# EAGLE design DTAG02 (EAGLE 4.15)
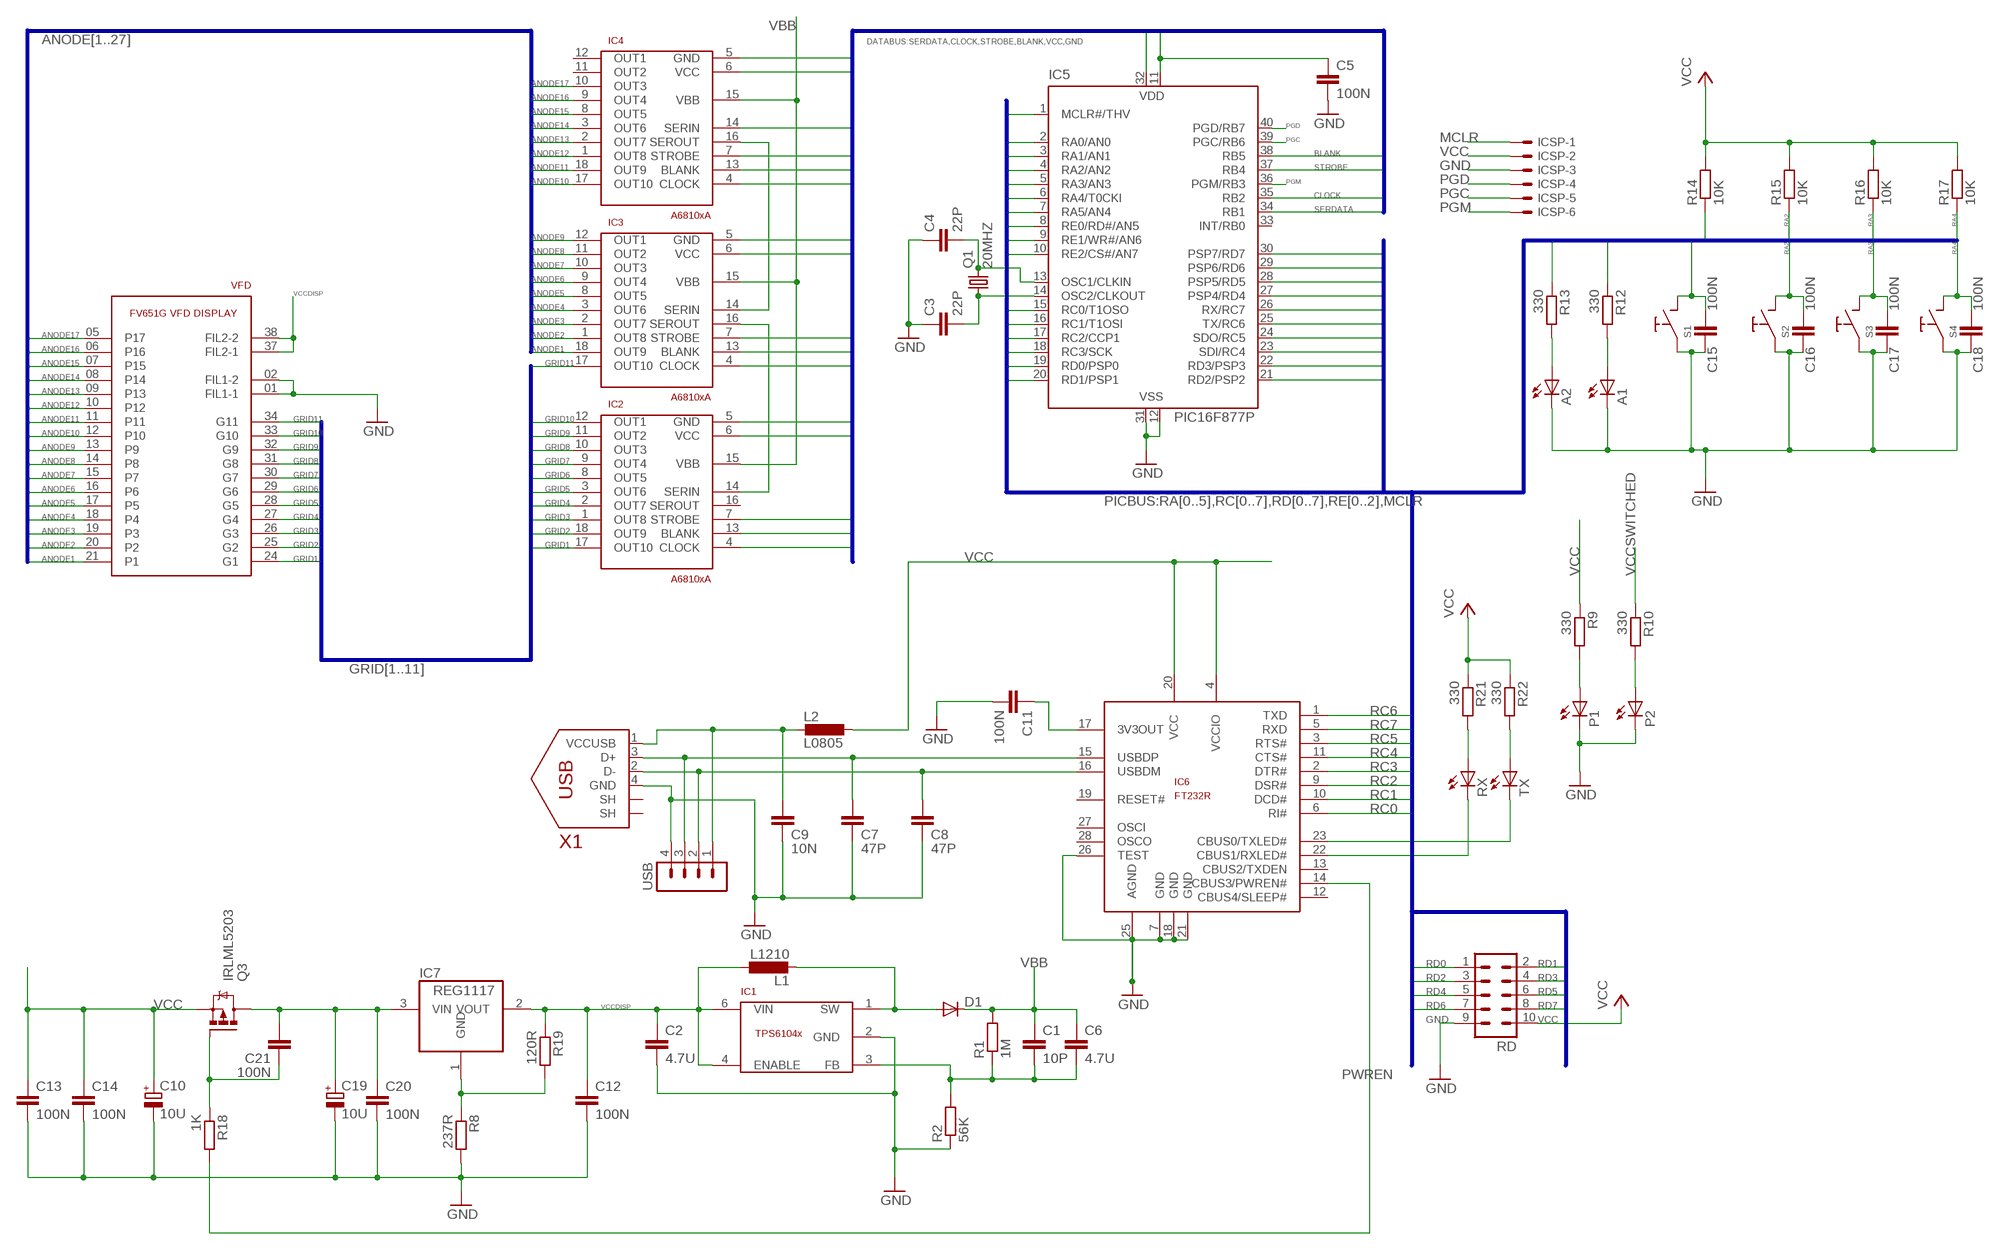
[diagram p0: schematic, sheet 1]

## Parts
A1  LEDCHIP-LED0805  [CHIP-LED0805]
A2  LEDCHIP-LED0805  [CHIP-LED0805]
C1  10P  C-EUC0805K  [C0805K]
C2  4.7U  C-EUC1210  [C1210]
C3  22P  C-EUC0805K  [C0805K]
C4  22P  C-EUC0805K  [C0805K]
C5  100N  C-EUC0805K  [C0805K]
C6  4.7U  C-EUC1210  [C1210]
C7  47P  C-EUC0805K  [C0805K]
C8  47P  C-EUC0805K  [C0805K]
C9  10N  C-EUC0805K  [C0805K]
C10  10U  CPOL-EUSMCD  [SMC_D]
C11  100N  C-EUC0805K  [C0805K]
C12  100N  C-EUC0805K  [C0805K]
C13  100N  C-EUC0805K  [C0805K]
C14  100N  C-EUC0805K  [C0805K]
C15  100N  C-EUC0805K  [C0805K]
C16  100N  C-EUC0805K  [C0805K]
C17  100N  C-EUC0805K  [C0805K]
C18  100N  C-EUC0805K  [C0805K]
C19  10U  CPOL-EUSMCD  [SMC_D]
C20  100N  C-EUC0805K  [C0805K]
C21  100N  C-EUC0805K  [C0805K]
D1  DIODE-POWERMITE  [POWERMITE]
IC1  TPS6104X  [SOT23-6L]
IC2  A6810  [DIL18]
IC3  A6810  [DIL18]
IC4  A6810  [DIL18]
IC5  PIC16F877P  [DIL40]
IC6  FT232R  [SSOP28]
IC7  REG1117  [SOT223]
ICSP  53048-06  [53048-06]
L1  L1210  [C1210]
L2  L0805  [C0805]
P1  LEDCHIP-LED0805  [CHIP-LED0805]
P2  LEDCHIP-LED0805  [CHIP-LED0805]
Q1  20MHZ  CRYTALHC49S  [HC49/S]
Q3  IRLML5203  [MICRO3]
R1  1M  R-EU_R0805  [R0805]
R2  56K  R-EU_R0805  [R0805]
R8  237R  R-EU_R0805  [R0805]
R9  330  R-EU_R0805  [R0805]
R10  330  R-EU_R0805  [R0805]
R12  330  R-EU_R0805  [R0805]
R13  330  R-EU_R0805  [R0805]
R14  10K  R-EU_R0805  [R0805]
R15  10K  R-EU_R0805  [R0805]
R16  10K  R-EU_R0805  [R0805]
R17  10K  R-EU_R0805  [R0805]
R18  1K  R-EU_R0805  [R0805]
R19  120R  R-EU_R0805  [R0805]
R21  330  R-EU_R0805  [R0805]
R22  330  R-EU_R0805  [R0805]
RD  MA05-2  [MA05-2]
RX  LEDCHIP-LED0805  [CHIP-LED0805]
S1  TASTER  [TASTER01]
S2  TASTER  [TASTER01]
S3  TASTER  [TASTER01]
S4  TASTER  [TASTER01]
TX  LEDCHIP-LED0805  [CHIP-LED0805]
USB  MA04-1  [MA04-1]
VFD  FV651G  [FV651G]
X1  USBCONN  [PN61729]

## Nets
ANODE1: IC3.18(OUT9) VFD.21(P1)
ANODE2: IC3.1(OUT8) VFD.20(P2)
ANODE3: IC3.2(OUT7) VFD.19(P3)
ANODE4: IC3.3(OUT6) VFD.18(P4)
ANODE5: IC3.8(OUT5) VFD.17(P5)
ANODE6: IC3.9(OUT4) VFD.16(P6)
ANODE7: IC3.10(OUT3) VFD.15(P7)
ANODE8: IC3.11(OUT2) VFD.14(P8)
ANODE9: IC3.12(OUT1) VFD.13(P9)
ANODE10: IC4.17(OUT10) VFD.12(P10)
ANODE11: IC4.18(OUT9) VFD.11
ANODE12: IC4.1(OUT8) VFD.10(P12)
ANODE13: IC4.2(OUT7) VFD.09(P13)
ANODE14: IC4.3(OUT6) VFD.08(P14)
ANODE15: IC4.8(OUT5) VFD.07(P15)
ANODE16: IC4.9(OUT4) VFD.06(P16)
ANODE17: IC4.10(OUT3) VFD.05(P17)
BLANK: IC2.13(BLANK) IC3.13(BLANK) IC4.13(BLANK) IC5.38(RB5)
CLOCK: IC2.4(CLOCK) IC3.4(CLOCK) IC4.4(CLOCK) IC5.35(RB2)
GND: A1.C A2.C C2.2 C3.1 C4.1 C5.2 C7.1 C8.1 C9.1 C10.- C11.2 C12.2 C13.2 C14.2 C15.1 C16.1 C17.1 C18.1 C19.- C20.2 IC1.2(GND) IC2.5(GND) IC3.5(GND) IC4.5(GND) IC5.12(VSS) IC5.31(VSS) IC6.7(GND) IC6.18(GND) IC6.21(GND) IC6.25(AGND) IC6.26(TEST) ICSP.3 P1.C P2.C R2.1 R8.2 RD.9 S1.S1 S2.S1 S3.S1 S4.S1 USB.4 VFD.01(FIL1-1) VFD.02(FIL1-2) X1.4(GND)
GRID1: IC2.17(OUT10) VFD.24(G1)
GRID2: IC2.18(OUT9) VFD.25(G2)
GRID3: IC2.1(OUT8) VFD.26(G3)
GRID4: IC2.2(OUT7) VFD.27(G4)
GRID5: IC2.3(OUT6) VFD.28(G5)
GRID6: IC2.8(OUT5) VFD.29(G6)
GRID7: IC2.9(OUT4) VFD.30(G7)
GRID8: IC2.10(OUT3) VFD.31(G8)
GRID9: IC2.11(OUT2) VFD.32(G9)
GRID10: IC2.12(OUT1) VFD.33(G10)
GRID11: IC3.17(OUT10) VFD.34(G11)
MCLR: C15.2 IC5.1(MCLR#/THV) ICSP.1 R14.1 S1.S2
N$1: IC3.14(SERIN) IC4.16(SEROUT)
N$2: IC2.14(SERIN) IC3.16(SEROUT)
N$3: C4.2 IC5.13(OSC1/CLKIN) Q1.2
N$4: C3.2 IC5.14(OSC2/CLKOUT) Q1.1
N$5: IC6.23(CBUS0/TXLED#) TX.C
N$6: C7.2 IC6.15(USBDP) USB.3 X1.3(D+)
N$7: C8.2 IC6.16(USBDM) USB.2 X1.2(D-)
N$8: C11.1 IC6.17(3V3OUT)
N$14: C21.1 Q3.1(G) R18.1
N$15: C9.2 L2.2 USB.1 X1.1(VCCUSB)
N$16: IC7.1(GND) R8.1 R19.2
N$17: D1.P$2(A) IC1.1(SW) L1.2
N$19: A2.A R13.2
N$20: C1.2 C6.2 IC1.3(FB) R1.1 R2.2
N$21: A1.A R12.2
N$22: P2.A R10.2
N$25: P1.A R9.2
N$30: R21.2 RX.A
N$31: R22.2 TX.A
N$32: IC6.22(CBUS1/RXLED#) RX.C
PGC: IC5.39(PGC/RB6) ICSP.5
PGD: IC5.40(PGD/RB7) ICSP.4
PGM: IC5.36(PGM/RB3) ICSP.6
PWREN: IC6.14(CBUS3/PWREN#) R18.2
RA0: IC5.2(RA0/AN0) R13.1
RA1: IC5.3(RA1/AN1) R12.1
RA2: C16.2 IC5.4(RA2/AN2) R15.1 S2.S2
RA3: C17.2 IC5.5(RA3/AN3) R16.1 S3.S2
RA4: C18.2 IC5.6(RA4/T0CKI) R17.1 S4.S2
RA5: IC5.7(RA5/AN4)
RC0: IC5.15(RC0/T1OSO) IC6.6(RI#)
RC1: IC5.16(RC1/T1OSI) IC6.10(DCD#)
RC2: IC5.17(RC2/CCP1) IC6.9(DSR#)
RC3: IC5.18(RC3/SCK) IC6.2(DTR#)
RC4: IC5.23(SDI/RC4) IC6.11(CTS#)
RC5: IC5.24(SDO/RC5) IC6.3(RTS#)
RC6: IC5.25(TX/RC6) IC6.1(TXD)
RC7: IC5.26(RX/RC7) IC6.5(RXD)
RD0: IC5.19(RD0/PSP0) RD.1
RD1: IC5.20(RD1/PSP1) RD.2
RD2: IC5.21(RD2/PSP2) RD.3
RD3: IC5.22(RD3/PSP3) RD.4
RD4: IC5.27(PSP4/RD4) RD.5
RD5: IC5.28(PSP5/RD5) RD.6
RD6: IC5.29(PSP6/RD6) RD.7
RD7: IC5.30(PSP7/RD7) RD.8
RE0: IC5.8(RE0/RD#/AN5)
RE1: IC5.9(RE1/WR#/AN6)
RE2: IC5.10(RE2/CS#/AN7)
SERDATA: IC4.14(SERIN) IC5.34(RB1)
STROBE: IC2.7(STROBE) IC3.7(STROBE) IC4.7(STROBE) IC5.37(RB4)
VBB: C1.1 C6.1 D1.P$1(C) IC2.15(VBB) IC3.15(VBB) IC4.15(VBB) R1.2
VCC: C5.1 C10.+ C13.1 C14.1 IC2.6(VCC) IC3.6(VCC) IC4.6(VCC) IC5.11(VDD) IC5.32(VDD) IC6.4(VCCIO) IC6.20(VCC) ICSP.2 L2.1 Q3.2(S) R9.1 R14.2 R15.2 R16.2 R17.2 R21.1 R22.1 RD.10
VCCDISP: C2.1 C12.1 IC1.4(ENABLE) IC1.6(VIN) IC7.2(VOUT) L1.1 R19.1 VFD.37(FIL2-1) VFD.38(FIL2-2)
VCCSWITCHED: C19.+ C20.1 C21.2 IC7.3(VIN) Q3.3(D) R10.1
Unconnected: IC2.16(SEROUT) IC4.11(OUT2) IC4.12(OUT1) IC5.33(INT/RB0) IC6.12(CBUS4/SLEEP#) IC6.13(CBUS2/TXDEN) IC6.19(RESET#) IC6.27(OSCI) IC6.28(OSCO) X1.SHIELD1(SH) X1.SHIELD2(SH)

## Buses
GRID[1..11]
ANODE[1..27]
DATABUS:SERDATA,CLOCK,STROBE,BLANK,VCC,GND
PICBUS:RA[0..5],RC[0..7],RD[0..7],RE[0..2],MCLR

## Library data of the parts
A1 A2 P1 P2 RX TX = led:LED: LED OSRAM: - CHIPLED LG R971, LG N971, LY N971, LG Q971, LY Q971, LO R971, LY R971 LH N974, LH R974 LS Q976, LO Q976, LY Q976 LO Q996 - Hyper CHIPLED LW Q18S LB Q993, LB Q99A, LB R99A - SideLED LS A670, LO A670, LY A670, LG A670, LP A670 LB A673, LV A673, LT A673, LW A673 LH A674 LY A675 LS A676, LA A676, LO A676, LY A676, LW A676 LS A679, LY A679, LG A679 - Hyper Micro SIDELED® LS Y876, LA Y876, LO Y876, LY Y876 LT Y87S - SmartLED LW L88C, LW L88S LB L89C, LB L89S, LG L890 LS L89K, LO L89K, LY L89K LS L896, LA L896, LO L896, LY L896 - TOPLED LS T670, LO T670, LY T670, LG T670, LP T670 LSG T670, LSP T670, LSY T670, LOP T670, LYG T670 LG T671, LOG T671, LSG T671 LB T673, LV T673, LT T673, LW T673 LH T674 LS T676, LA T676, LO T676, LY T676, LB T676, LH T676, LSB T676, LW T676 LB T67C, LV T67C, LT T67C, LS T67K, LO T67K, LY T67K, LW E67C LS E67B, LA E67B, LO E67B, LY E67B, LB E67C, LV E67C, LT E67C LW T67C LS T679, LY T679, LG T679 LS T770, LO T770, LY T770, LG T770, LP T770 LB T773, LV T773, LT T773, LW T773 LH T774 LS E675, LA E675, LY E675, LS T675 LS T776, LA T776, LO T776, LY T776, LB T776 LHGB T686 LT T68C, LB T68C - Hyper Mini TOPLED® LB M676 - Mini TOPLED Santana® LG M470 LS M47K, LO M47K, LY M47K Source: http://www.osram.convergy.de/
C1 C3-C5 C7-C9 C11-C18 C20 C21 = rcl:C-EU: CAPACITOR, European symbol
C2 C6 = turbod3:C-EU: CAPACITOR, European symbol
C10 C19 = rcl:CPOL-EU: POLARIZED CAPACITOR, European symbol
D1 = turbod3:DIODE-POWERMITE
IC1 = turbod3:TPS6104X
IC2-IC4 = turbod3:A6810
IC5 = microchip:PIC16F87*: MICROCONTROLLER
IC6 = turbod3:FT232R
IC7 = burr-brown:REG1117: 800mA and 1A Low Dropout (LDO) Positive Regulator 1.8V, 2.5V, 2.85V, 3.3V, 5V, and Adj
ICSP = con-molex:53?-06: CONNECTOR wire to board 1.25 mm (.049 inch) pitch header
L1 L2 = turbod3:L
Q1 = turbod3:CRYTAL: CRYSTAL
Q3 = transistor-power:IRLML5203: HEXFET P-Channel Power MOSFET
R1 R2 R8-R10 R12-R19 R21 R22 = rcl:R-EU_: RESISTOR, European symbol
RD = con-lstb:MA05-2: PIN HEADER
S1-S4 = turbod3:TASTER
USB = con-lstb:MA04-1: PIN HEADER
VFD = turbod3:FV651G
X1 = turbod3:USBCONN

## Net classes
0 default: width 0.25 mm, drill 0.006 mm

## Board
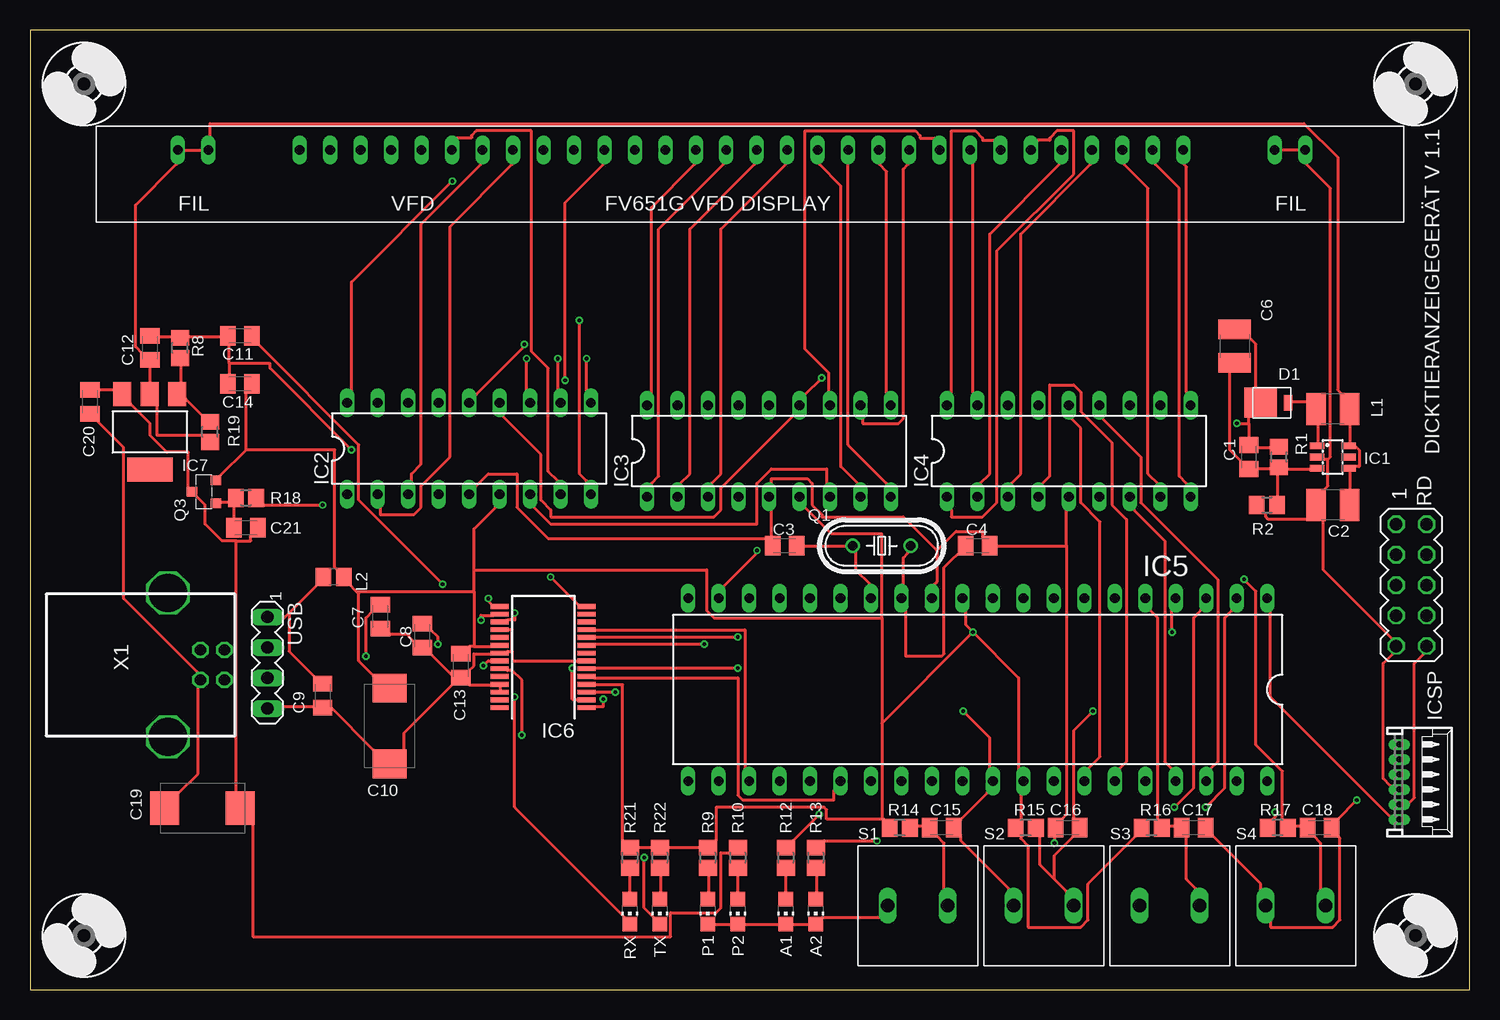
[diagram p1: board, top side]
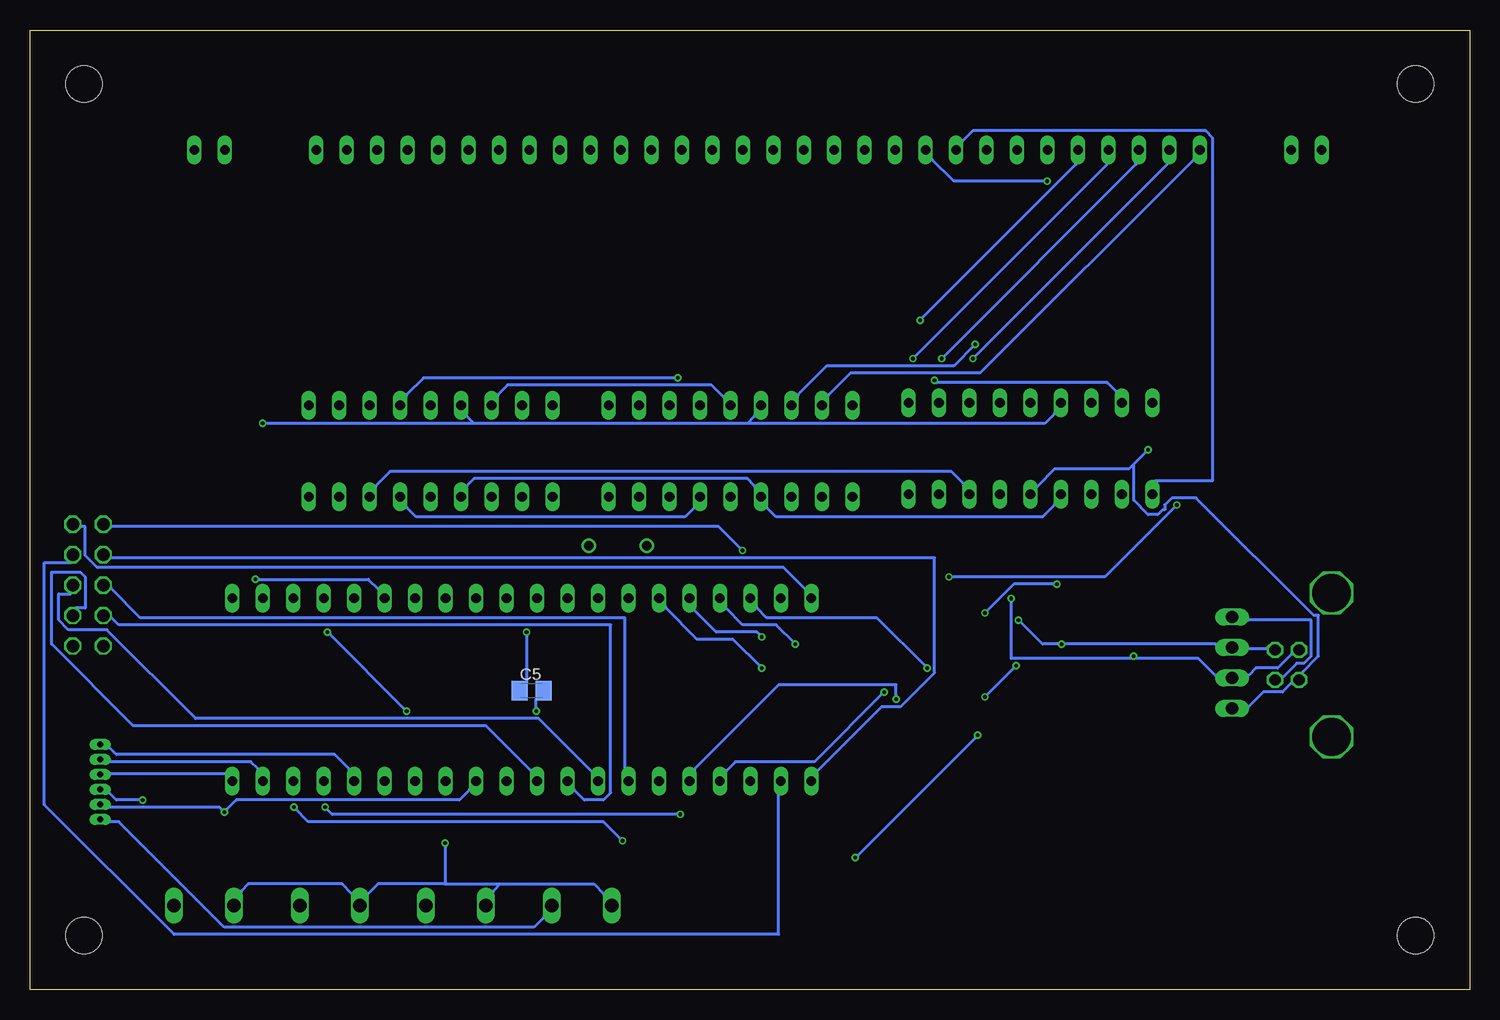
[diagram p2: board, bottom side, seen from below]

Size 120 x 80 mm. Coordinates in mm from the lower left corner, seen from the top.
Outline: 0,0 120,0 120,80 0,80 0,0
Copper layers (1*16): Top 0.035mm / dielectric 1.5mm / Bottom 0.035mm
Design rules "PCB-POOL": minimum track width 6mil, minimum drill 12mil, track to track 6mil, track to pad 6mil, pad to pad 6mil, via to via 6mil, smd to smd 6mil, copper to edge 20mil, drill to drill 8mil, minimum pad ring 8mil, minimum via ring 6mil, stop-mask expansion 3mil, vias tented up to drill 0mil, thermal gap 8mil
tRestrict: area 112,34.5 to 113,38

### Footprints (pad centres in the part's own frame; a part is rotated, then mirrored left to right if it is on the bottom)
CHIP-LED0805 = smd 1.2 x 1.2: A 0,-1.05; C 0,1.05
C0805K = smd 1.3 x 1.6: 1 -1,0; 2 1,0
C1210 = smd 1.6 x 2.7: 1 -1.4,0; 2 1.4,0
SMC_D = smd 2.4 x 2.8: + -3.15,0; - 3.15,0
POWERMITE = smd 2.7 x 2.5: P$1 0,0 | smd 0.7 x 1.3: P$2 2.3,0
SOT23-6L = smd 0.55 x 1.2: 1 -0.95,-1.3; 2 0,-1.3; 3 0.95,-1.3; 4 0.95,1.3; 5 0,1.3; 6 -0.95,1.3
DIL18 = drill 0.813 long: 1 -10.16,-3.81; 2 -7.62,-3.81; 3 -5.08,-3.81; 4 -2.54,-3.81; 5 0,-3.81; 6 2.54,-3.81; 7 5.08,-3.81; 8 7.62,-3.81; 9 10.16,-3.81; 10 10.16,3.81; 11 7.62,3.81; 12 5.08,3.81; 13 2.54,3.81; 14 0,3.81; 15 -2.54,3.81; 16 -5.08,3.81; 17 -7.62,3.81; 18 -10.16,3.81
DIL40 = drill 0.813 long: 1 -24.13,-7.62; 2 -21.59,-7.62; 3 -19.05,-7.62; 4 -16.51,-7.62; 5 -13.97,-7.62; 6 -11.43,-7.62; 7 -8.89,-7.62; 8 -6.35,-7.62; 9 -3.81,-7.62; 10 -1.27,-7.62; 11 1.27,-7.62; 12 3.81,-7.62; 13 6.35,-7.62; 14 8.89,-7.62; 15 11.43,-7.62; 16 13.97,-7.62; 17 16.51,-7.62; 18 19.05,-7.62; 19 21.59,-7.62; 20 24.13,-7.62; 21 24.13,7.62; 22 21.59,7.62; 23 19.05,7.62; 24 16.51,7.62; 25 13.97,7.62; 26 11.43,7.62; 27 8.89,7.62; 28 6.35,7.62; 29 3.81,7.62; 30 1.27,7.62; 31 -1.27,7.62; 32 -3.81,7.62; 33 -6.35,7.62; 34 -8.89,7.62; 35 -11.43,7.62; 36 -13.97,7.62; 37 -16.51,7.62; 38 -19.05,7.62; 39 -21.59,7.62; 40 -24.13,7.62
SSOP28 = smd 0.4 x 1.5: 1 -4.225,-3.625; 2 -3.575,-3.625; 3 -2.925,-3.625; 4 -2.275,-3.625; 5 -1.625,-3.625; 6 -0.975,-3.625; 7 -0.325,-3.625; 8 0.325,-3.625; 9 0.975,-3.625; 10 1.625,-3.625; 11 2.275,-3.625; 12 2.925,-3.625; 13 3.575,-3.625; 14 4.225,-3.625; 15 4.225,3.625; 16 3.575,3.625; 17 2.925,3.625; 18 2.275,3.625; 19 1.625,3.625; 20 0.975,3.625; 21 0.325,3.625; 22 -0.325,3.625; 23 -0.975,3.625; 24 -1.625,3.625; 25 -2.275,3.625; 26 -2.925,3.625; 27 -3.575,3.625; 28 -4.225,3.625
SOT223 = smd 1.499 x 2.007: 1 -2.261,-3.15; 2 0.025,-3.15; 3 2.311,-3.15 | smd 3.81 x 2.007: 4 0,3.15
53048-06 = drill 0.5 pad 0.698 long: 1 3.125,-1.25; 2 1.875,-1.25; 3 0.625,-1.25; 4 -0.625,-1.25; 5 -1.875,-1.25; 6 -3.125,-1.25
C0805 = smd 1.3 x 1.5: 1 -0.85,0; 2 0.85,0
HC49/S = drill 0.813 round: 1 -2.413,0; 2 2.413,0
MICRO3 = smd 0.8 x 0.9: 1 -0.95,-1; 2 0.95,-1; 3 0,1
R0805 = smd 1.3 x 1.5: 1 -0.85,0; 2 0.85,0
MA05-2 = drill 1.016 octagon: 1 -5.08,-1.27; 2 -5.08,1.27; 3 -2.54,-1.27; 4 -2.54,1.27; 5 0,-1.27; 6 0,1.27; 7 2.54,-1.27; 8 2.54,1.27; 9 5.08,-1.27; 10 5.08,1.27
TASTER01 = drill 1.1 long: S1 -2.5,0; S2 2.5,0
3,0 = hole 3: 0,0
MA04-1 = drill 1.016 long: 1 -3.81,0; 2 -1.27,0; 3 1.27,0; 4 3.81,0
FV651G = drill 0.8 long: 01 50.8,0; 02 48.26,0; 05 40.64,0; 06 38.1,0; 07 35.56,0; 08 33.02,0; 09 30.48,0; 10 27.94,0; 11 25.4,0; 12 22.86,0; 13 20.32,0; 14 17.78,0; 15 15.24,0; 16 12.7,0; 17 10.16,0; 18 7.62,0; 19 5.08,0; 20 2.54,0; 21 0,0; 22 -2.54,0; 23 -5.08,0; 24 -7.62,0; 25 -10.16,0; 26 -12.7,0; 27 -15.24,0; 28 -17.78,0; 29 -20.32,0; 30 -22.86,0; 31 -25.4,0; 32 -27.94,0; 33 -30.48,0; 34 -33.02,0; 37 -40.64,0; 38 -43.18,0
PN61729 = drill 0.95 octagon: 1 1.25,4.71; 2 -1.25,4.71; 3 -1.25,2.71; 4 1.25,2.71 | drill 3.2 octagon: SHIELD1 -6,0; SHIELD2 6,0

### Placement (x,y rotation side)
A1  63,6.5 180 top
A2  65.5,6.5 180 top
C1  101.6,44.4 270 top
C2  108.6,40.4 180 top
C3  62.9,37 0 top
C4  79,37 180 top
C5  78.19,24.92 0 bottom
C6  100.42,53.65 270 top
C7  29.2,31.1 90 top
C8  32.7,29.5 90 top
C9  24.4,24.5 90 top
C10  29.98,21.97 270 top
C11  17.5,54.5 180 top
C12  10,53.5 90 top
C13  35.92,27.01 270 top
C14  17.5,50.5 180 top
C15  76,13.5 180 top
C16  86.5,13.5 0 top
C17  97,13.5 180 top
C18  107.5,13.5 180 top
C19  14.38,15.12 180 top
C20  5,49 270 top
C21  18,38.5 0 top
D1  102.58,48.92 0 top
IC1  108.6,44.4 270 top
IC2  36.6,45.1 0 top
IC3  61.6,44.9 0 top
IC4  86.6,44.9 0 top
IC5  79,25 180 top
IC6  42.79,27.72 90 top
IC7  10,46.5 180 top
ICSP  115.4,17.3 270 top
L1  108.6,48.4 180 top
L2  25.3,34.4 180 top
P1  56.5,6.5 180 top
P2  59,6.5 180 top
Q1  71,37 0 top
Q3  14.5,41.5 90 top
R1  104.1,44.4 90 top
R2  103.1,40.4 0 top
R8  12.5,53.5 90 top
R9  56.5,11 270 top
R10  59,11 270 top
R12  63,11 270 top
R13  65.5,11 270 top
R14  72.5,13.5 180 top
R15  83,13.5 180 top
R16  93.5,13.5 180 top
R17  104,13.5 180 top
R18  18,41 0 top
R19  15,46.5 90 top
R21  50,11 270 top
R22  52.5,11 270 top
RD  115.15,33.71 270 top
RX  50,6.5 180 top
S1  74,7 0 top
S2  84.5,7 0 top
S3  95,7 0 top
S4  105.5,7 0 top
TX  52.5,6.5 180 top
U$1  [3,0]  4.5,75.5 0 top
U$2  [3,0]  115.5,75.5 0 top
U$4  [3,0]  115.5,4.5 0 top
U$5  [3,0]  4.5,4.5 0 top
USB  19.79,27.24 270 top
VFD  55.5,70 0 top
X1  11.5,27.06 270 top

### Tracks (layer width: path | path; a pad name or v marks a point on that pad's centre or on a via)
ANODE1
  Top 0.25: VFD.21 55.4,68.8 51.8,65.2 51.8,49.8 IC3.18
ANODE2
  Top 0.25: VFD.20 57.8,68.8 52.4,63.4 52.4,42.8 51.8,42.2 IC3.1
ANODE3
  Top 0.25: VFD.19 60.4,68.8 55,63.4 55,43 54.2,42.2 IC3.2
ANODE4
  Top 0.25: VFD.18 63,68.8 57.6,63.4 57.6,43 56.8,42.2 IC3.3
ANODE5
  Top 0.25: VFD.17 65.8,68.8 67.6,67 67.6,43.6 69,42.2 IC3.8
ANODE6
  Top 0.25: VFD.16 68.2,45.4 71.4,42.2 IC3.9
ANODE7
  Top 0.25: VFD.15 70.8,68.8 71.4,68.2 71.4,49.8 IC3.10
ANODE8
  Top 0.25: VFD.14 73.2,68.8 72.8,68.4 72.8,47.6 72.4,47.2 69.4,47.2 69.4,47.6 IC3.11
ANODE9
  Top 0.25: VFD.13 75.4,71 74.2,71 74.2,71.2 73.8,71.6 64.6,71.6 64.6,53.4 66.6,51.4 66.6,49.8 IC3.12
ANODE10
  Top 0.25: VFD.12 78.6,68.8 78.6,49.8 IC4.17
ANODE11
  Top 0.25: VFD.11 80.4,70.8 79.4,70.8 79.4,71 78.8,71.6 76.8,71.6 76.8,49.8 IC4.18
ANODE12
  Top 0.25: VFD.10 84,70.8 85,70.8 85,71 85.6,71.6 87,71.6 87,68 80.6,61.6 80.6,40.6 79.4,39.4 76.8,39.4 76.8,40 IC4.1
ANODE13
  Top 0.25: VFD.09 85.8,68.8 80,63 80,43 79.2,42.2 IC4.2
ANODE14
  Top 0.25: VFD.08 88.4,68.8 82.6,63 82.6,43 81.8,42.2 IC4.3
ANODE15
  Top 0.25: VFD.07 91.2,68.8 93.2,66.8 93.2,43 94,42.2 IC4.8
ANODE16
  Top 0.25: VFD.06 93.8,68.8 95.8,66.8 95.8,42.8 96.4,42.2 IC4.9
ANODE17
  Top 0.25: VFD.05 96.2,68.8 96.4,68.6 96.4,49.8 IC4.10
BLANK  (via drill 0.3)
  Top 0.25: IC2.13 39.4,47.8 42.6,44.6 42.6,40.8 43.4,40 43.4,39.4 57,39.4 57.6,40 57.6,41.8 63.6,47.8 IC3.13 64.6,49.6 v66,51 | IC5.38 98.4,18.4 99,19 99,34.2 92.6,40.6 92.6,44.4 89.4,47.6 IC4.13
  Bottom 0.25: v66,51 87.2,51 88.6,49.6 IC4.13
CLOCK
  Top 0.25: IC5.35 90.8,18.4 91.4,19 91.4,39.2 90.2,40.4 90.2,45.6 87.6,48.2 87.6,49.8 87,50.4 85,50.4 85,42.8 84.4,42.2 IC4.4
  Bottom 0.25: IC4.4 83.6,42 83,42.6 60.2,42.6 59.6,42 IC3.4 58.6,40.2 57.8,39.4 35.6,39.4 34.6,40.4 IC2.4
GND  (via drill 0.3)
  Top 0.25: ICSP.3 113.4,17 112.8,17.6 112.8,27.2 113.6,28 RD.9 113.6,29.2 107.8,35 107.8,39.2 C2.2 | VFD.02 VFD.01 106.4,68.8 108.4,66.8 108.4,44.4 108.2,44.2 | 108.2,44.2 107.8,44.2 IC1.2 | 108.2,44.2 108.2,42 107.8,41.6 C2.2 | R2.1 102.8,39.8 103,39.6 103,39.4 103.2,39.2 106.6,39.2 C2.2 | C17.1 98.6,12.8 102.6,8.8 102.6,8.4 S4.S1 103.4,5.6 103.4,5.2 108.6,5.2 109.2,5.8 109.2,12.6 109,12.8 C18.1 109,14.2 v110.6,15.8 | P1.C 57,5.4 58.6,5.4 P2.C 59.4,5.4 62.6,5.4 A1.C 63.4,5.4 65,5.4 A2.C 66,6 70.8,6 S1.S1 | v77.8,23.2 80,21 80,18.4 IC5.31 79.8,16.4 77.6,14.2 C15.1 77.6,12.8 77.6,12.4 81.6,8.4 S2.S1 | IC6.26 39.2,24.8 39.2,25.4 IC6.25 38.6,25.4 36.6,25.4 C13.2 | C13.2 36.6,26.6 37,27 37,28 38.6,28 IC6.21 39.8,28.2 40.2,28.2 | 40.2,28.2 40.2,30 39.8,30 IC6.18 | 40.2,28.2 40.2,27.4 45.8,27.4 IC6.7 | C13.2 35.2,26.2 33.4,28 C8.1 32,29 31.6,29.4 31.6,29.6 29.8,29.6 C7.1 | USB.4 21.2,23.6 23.8,23.6 C9.1 25,23.6 28.6,20 C10.- 31.2,20 31.2,21.4 35.2,25.4 C13.2 | C20.2 7.8,45.2 7.8,32.6 14,26.4 X1.4 14,25.2 14,18 12.4,16.4 C19.- | 86.4,37 86.4,40 IC4.5 | 86.4,37 86.4,14.6 86,14.2 C16.1 85.4,12.8 v85.4,12.2 | 86.4,37 C4.1 79.4,37.6 79.4,38.2 77.2,38.2 75.6,36.6 | 75.6,36.6 75.6,34 75.4,33.8 IC5.12 | C12.2 10.6,54.4 11.8,54.4 R8.2 13.2,54.4 16,54.4 C11.2 16.6,53.8 16.6,52.2 | 16.6,52.2 16.6,51.2 C14.2 | IC2.5 37.2,42 38.2,43 40.6,43 40.6,40.2 43.2,37.6 61.4,37.6 C3.1 61.8,37.6 61.8,40 IC3.5 61.8,42.2 61.8,42.6 64.8,42.6 65.2,42.2 65.2,40.4 66,39.6 66,39.4 72.8,39.4 75.6,36.6 | 16.6,52.2 20,52.2 20,51.8 v26.8,45
  Bottom 0.25: S4.S1 102.4,8.2 101.8,8.8 94,8.8 93.2,8 S3.S1 91.8,8 91,8.8 85.4,8.8 | v77.8,23.2 77.8,24.2 C5.2 | 80.8,8.8 73,8.8 72.2,8 S1.S1 | 80.8,8.8 81.4,8.2 S2.S1 | 85.4,8.8 80.8,8.8 | v110.6,15.8 112.8,15.8 113.4,16.4 ICSP.3 | USB.4 18.4,23.6 17.2,24.8 15.6,24.8 14.8,25.6 X1.4 14,26.4 12.6,27.8 12.6,31.2 13,31.2 22.8,41 24.8,41 25.4,40.4 25.4,40 25.6,40 26,39.6 26.8,39.6 28,40.8 28,43.8 | 28,43.8 28.4,43.4 34.6,43.4 36,42 IC2.5 | 28,43.8 v26.8,45 | v85.4,12.2 85.4,8.8
GRID1  (via drill 0.3)
  Top 0.25: v44.6,50.8 44.6,65.6 47.8,68.8 VFD.24
  Bottom 0.25: v44.6,50.8 44.4,50.6 30.2,50.6 29.4,49.8 IC2.17
GRID2  (via drill 0.3)
  Top 0.25: v35.2,67.4 26.8,59 26.8,50 IC2.18
  Bottom 0.25: v35.2,67.4 43,67.4 44.8,69.2 VFD.25
GRID3
  Bottom 0.25: VFD.26 42.2,70.8 41.4,71.6 22,71.6 21.4,71 21.4,42.4 26.2,42.4 IC2.1
GRID4
  Top 0.25: VFD.27 40.2,68.8 35,63.6 35,44.4 32.6,42 32.6,40.2 32,39.6 29.2,39.6 29.2,40.2 IC2.2
GRID5
  Top 0.25: VFD.28 37.6,68.8 32.6,63.8 32.6,43.8 31.8,43 31.8,42.4 IC2.3
GRID6
  Top 0.25: VFD.29 35.6,71 36.8,71 36.8,71.2 37.2,71.6 41.8,71.6 41.8,53.2 43.2,51.8 43.2,43.2 44,42.4 IC2.8
GRID7  (via drill 0.3)
  Top 0.25: v45.8,55.8 45.8,43 46.4,42.4 IC2.9
  Bottom 0.25: v45.8,55.8 32.8,68.8 VFD.30
GRID8  (via drill 0.3)
  Top 0.25: v46.4,52.6 46.4,50 IC2.10
  Bottom 0.25: v46.4,52.6 30.2,68.8 VFD.31
GRID9  (via drill 0.3)
  Top 0.25: v44,52.6 44,50 IC2.11
  Bottom 0.25: v44,52.6 27.8,68.8 VFD.32
GRID10  (via drill 0.3)
  Top 0.25: v41.4,52.6 41.4,50 IC2.12
  Bottom 0.25: v41.4,52.6 25.2,68.8 VFD.33
GRID11
  Bottom 0.25: VFD.34 23,69.2 40.8,51.4 51.6,51.4 53.4,49.6 IC3.17
MCLR
  Top 0.25: R14.1 73.8,13.6 74.4,13.6 C15.2 75.6,12.8 76.2,12.2 76.2,8.4 S1.S2 | ICSP.1 113.4,14.4 103.4,24.4 103.4,31.6 IC5.1
  Bottom 0.25: S1.S2 77.2,6 78,5.2 103.8,5.2 112.6,14 113.4,14 ICSP.1
N$1
  Bottom 0.25: IC3.14 62.2,49.4 63.2,50.4 80.2,50.4 81,49.6 IC4.16
N$2  (via drill 0.3)
  Top 0.25: v41.2,53.8 41.2,53.6 37.2,49.6 IC2.14
  Bottom 0.25: v41.2,53.8 43,52 53.6,52 56,49.6 IC3.16
N$3
  Top 0.25: C4.2 76.2,35.2 76.2,28 76,27.8 73,27.8 73,31.6 IC5.13 72.8,33.8 72.8,36 73.2,36.4 Q1.2
N$4
  Top 0.25: C3.2 Q1.1 68.8,36.4 68.8,35 70,33.8 IC5.14
N$5  (via drill 0.3)
  Top 0.25: v51.2,11 51.2,6.8 52,6 TX.C | v41,21.2 41,25.8 40.2,26.6 39.8,26.6 IC6.23
  Bottom 0.25: v51.2,11 v41,21.2
N$6  (via drill 0.3)
  Top 0.25: v38.2,32.6 38.2,32.4 38.6,32 IC6.15 | v28,27.8 28,31 28.6,31.6 C7.2
  Bottom 0.25: v38.2,32.6 38.2,27.6 28,27.6 | 28,27.6 22.6,27.6 21.2,26.2 USB.3 18.4,26.2 17.8,26.8 16,26.8 14.8,28 X1.3 | 28,27.6 v28,27.8
N$7  (via drill 0.3)
  Top 0.25: v37.6,30.8 37.6,31.2 38.6,31.2 IC6.16 | v34,28.8 34,29.4 33.4,30 C8.2
  Bottom 0.25: v37.6,30.8 35.6,28.8 v34,28.8 21.2,28.8 USB.2 18.4,28.4 16.8,28.4 X1.2
N$8  (via drill 0.3)
  Top 0.25: v40.4,31.4 40.4,30.8 39.8,30.8 IC6.17 | v34.4,33.8 27.4,40.8 27.4,45.4 19,53.8 C11.1
  Bottom 0.25: v40.4,31.4 38,33.8 v34.4,33.8
N$14
  Top 0.25: Q3.1 15.8,40.6 16.6,40.6 R18.1 17,40.4 C21.1
N$15
  Top 0.25: 21.6,31.4 21.2,31 USB.1 | 21.6,31.4 24,33.8 L2.2 | 21.6,31.4 21.6,28.2 23.8,26 C9.2
  Bottom 0.25: X1.1 15.6,26 14.4,27.2 13.8,27.2 13.2,27.8 13.2,30.8 18.4,30.8 USB.1
N$16
  Top 0.25: R19.2 14.4,47.8 13,49.2 IC7.1 12.6,50.6 12.6,52.2 R8.1
N$17
  Top 0.25: IC1.1 107.4,45.6 107.4,47.2 L1.2 106.6,49 105.2,49 D1.P$2
N$19
  Top 0.25: A2.A 65.6,8 65.6,9.6 R13.2
N$20
  Top 0.25: IC1.3 106.8,43.4 104.8,43.4 R1.1 | R2.2 104,41 104,43 R1.1 | R1.1 103.4,43.4 C1.2 100,45 100,51.6 C6.2
N$21
  Top 0.25: A1.A R12.2
N$22
  Top 0.25: P2.A R10.2
N$25
  Top 0.25: P1.A 56.6,8 56.6,9.6 R9.2
N$30
  Top 0.25: RX.A R21.2
N$31
  Top 0.25: TX.A 52.6,8 52.6,9.6 R22.2
N$32  (via drill 0.3)
  Top 0.25: v40.4,24.4 40.4,15.2 49.6,6 RX.C | v37.8,27 38.2,27.4 38.6,27.4 IC6.22
  Bottom 0.25: v40.4,24.4 v37.8,27
PGC
  Bottom 0.25: ICSP.5 113.4,19 101.6,19 101,18.4 IC5.39
PGD
  Bottom 0.25: ICSP.4 113.4,18 103.6,18 IC5.40
PGM
  Bottom 0.25: ICSP.6 113.4,20.2 112.8,19.6 94.6,19.6 93.4,18.4 IC5.36
PWREN  (via drill 0.3)
  Top 0.25: v24.4,40.4 19.4,40.4 R18.2 | v43.4,34.4 45.8,32 IC6.14
  Bottom 0.25: v24.4,40.4 30.4,34.4 v43.4,34.4
RA0  (via drill 0.3)
  Top 0.25: v70.6,12.4 66.2,12.4 R13.1 | v98,15.2 99.6,16.8 99.6,31 100.2,31.6 IC5.2
  Bottom 0.25: v70.6,12.4 72.2,14 96.8,14 v98,15.2
RA1  (via drill 0.3)
  Top 0.25: v65.8,14.6 63.6,12.4 R12.1 | v95.4,15.2 97,16.8 97,31 97.6,31.6 IC5.3
  Bottom 0.25: v65.8,14.6 94.8,14.6 v95.4,15.2
RA2  (via drill 0.3)
  Top 0.25: 85.4,9.2 86.4,8.2 S2.S2 | 85.4,9.2 84.2,10.4 84.2,12.8 R15.1 | 85.4,9.2 85.4,11.2 87,12.8 C16.2 87,14.2 87,21.6 v88.6,23.2 | v95.2,29.8 95.2,31.6 IC5.4
  Bottom 0.25: v88.6,23.2 v95.2,29.8
RA3
  Top 0.25: S3.S2 97.2,8.4 96.4,9.2 96.4,12.8 C17.2 95.4,13.6 94.8,13.6 R16.1 94,14.2 94,31 93.4,31.6 IC5.5
RA4  (via drill 0.3)
  Top 0.25: S4.S2 107.6,8.4 107.6,12.2 107,12.8 C18.2 106,13.6 105.4,13.6 R17.1 104.4,14.2 104.4,18.2 102.2,20.4 102.2,33.2 v101.2,34.2
  Bottom 0.25: v101.2,34.2 91.8,34.2 91,33.4 IC5.6
RC0  (via drill 0.3)
  Top 0.25: v59,26.8 47,26.8 IC6.6
  Bottom 0.25: v59,26.8 61.4,29.2 64.4,29.2 67,31.8 IC5.15
RC1  (via drill 0.3)
  Top 0.25: v59,29.4 47,29.4 IC6.10
  Bottom 0.25: v59,29.4 59.4,29.8 62.8,29.8 64.6,31.6 IC5.16
RC2  (via drill 0.3)
  Top 0.25: v56.2,28.8 47,28.8 IC6.9
  Bottom 0.25: v56.2,28.8 57.8,30.4 60.6,30.4 62,31.8 IC5.17
RC3  (via drill 0.3)
  Top 0.25: v45.2,26.8 45.2,24.2 45.8,24.2 IC6.2
  Bottom 0.25: v45.2,26.8 49.4,31 58.6,31 59.4,31.8 IC5.18
RC4
  Top 0.25: IC6.11 47,30 59.6,30 59.6,18.4 IC5.23
RC5  (via drill 0.3)
  Top 0.25: v48.8,24.8 47,24.8 IC6.3
  Bottom 0.25: v48.8,24.8 54.6,19 61.2,19 62,18.2 IC5.24
RC6  (via drill 0.3)
  Top 0.25: v47.8,24.2 47.8,23.6 47,23.6 IC6.1
  Bottom 0.25: v47.8,24.2 47.8,25.4 57.6,25.4 64.6,18.4 IC5.25
RC7
  Top 0.25: IC6.5 47,26 59,26 59,16.2 59.4,15.8 67,15.8 67,16.6 IC5.26
RD0  (via drill 0.3)
  Top 0.25: v60.6,36.6 60.6,36.4 57.8,33.6 IC5.19
  Bottom 0.25: v60.6,36.6 62.6,38.6 113.2,38.6 RD.1
RD1
  Bottom 0.25: IC5.20 55.4,33.4 57.2,35.2 114.4,35.2 115.4,36.2 115.4,38.6 115.8,38.6 RD.2
RD2
  Bottom 0.25: IC5.21 54.4,18.2 49,23.6 47.4,23.6 44.6,26.4 44.6,36 113.2,36 RD.3
RD3
  Bottom 0.25: IC5.22 57.6,16.2 57.6,4.6 108,4.6 118.8,15.4 118.8,35.6 116.6,35.6 RD.4
RD4
  Bottom 0.25: IC5.27 70.4,18.4 70.4,31 110.8,31 113.2,33.4 RD.5
RD5
  Bottom 0.25: IC5.28 73.2,18.2 77.6,22.6 106.2,22.6 113.6,30 116.8,30 117.6,30.8 117.6,33 116.6,33 RD.6
RD6
  Bottom 0.25: IC5.29 74.6,16.6 73.8,15.8 72.2,15.8 71.6,16.4 71.6,30.4 112.6,30.4 113.2,31 RD.7
RD7
  Bottom 0.25: IC5.30 78.2,18.2 82,22 111.4,22 118.2,28.8 118.2,34.8 115.8,34.8 115.4,34.4 115.4,31.8 116.2,31.8 RD.8
SERDATA
  Top 0.25: IC5.34 88.2,18.4 89.2,19.4 89.2,39 87.6,40.6 87.6,46.8 86.8,47.6 IC4.14
STROBE
  Top 0.25: IC2.7 42,40.2 43.4,38.8 60.6,38.8 60.6,42.2 61.8,43.4 66.4,43.4 66.4,42.2 IC3.7 | IC5.37 95.2,18.4 94.6,19 94.6,37.4 92,40 IC4.7
  Bottom 0.25: IC2.7 42.2,42.2 43.2,43.2 90,43.2 91.2,42 IC4.7
VBB  (via drill 0.3)
  Top 0.25: R1.2 103.4,45.2 102.2,45.2 C1.1 101.6,47.2 | 101.6,47.2 101.6,47.8 D1.P$1 102.2,50 102.2,53.8 101.6,54.4 C6.1 | v100.6,47.2 101.6,47.2
  Bottom 0.25: 60.2,47.2 59.6,47.8 IC3.15 | 60.2,47.2 83,47.2 | 83,47.2 83.6,47.8 IC4.15 | 60.2,47.2 35.4,47.2 34.6,48 IC2.15 | 83,47.2 v100.6,47.2
VCC  (via drill 0.3)
  Top 0.25: v103.8,14.8 103.8,14.4 103.6,14.2 R17.2 | RD.10 116.2,28 115.4,27.2 115.4,16 115,15.6 ICSP.2 | v78.6,29.8 78,30.4 78,31.6 IC5.11 | R16.2 92.2,12.8 88.2,8.8 88.2,5.8 87.6,5.2 83.2,5.2 83.2,12 82.6,12.6 82.6,12.8 R15.2 82.6,14.2 82.6,16.2 IC5.32 82.4,18.4 82.4,26 v78.6,29.8 | 37,28.6 36.6,28.6 C13.1 | 37,28.6 38.6,28.6 IC6.20 | 37,33.2 37,28.6 | 37,33.2 37,35 | 37,35 37,38.4 38.8,40.2 IC2.6 | 18,45 15.8,42.8 Q3.2 | 18,45 18,49.8 C14.1 | 27.2,33.2 27.4,33 27.4,27.4 28.6,26.2 C10.+ | 27.2,33.2 26.6,33.8 L2.1 25.6,35 25.4,35.2 25.4,45 18,45 | 27.2,33.2 37,33.2 | 71,14.2 66.4,14.2 66.4,15 66.2,15.2 57.2,15.2 57.2,12.4 R9.1 55.8,11.8 53.2,11.8 R22.1 51.8,11.8 50.6,11.8 R21.1 49.4,12.4 49.4,25.4 47,25.4 IC6.4 | 71,14.2 71.2,14.2 R14.2 | 71,22.2 71,14.2 | 71,31 71,22.2 | 71,31 71,38 66.8,38 64.6,40.2 IC3.6 | 37,35 56.4,35 56.4,31.6 57,31 71,31 | 71,22.2 v78.6,29.8
  Bottom 0.25: ICSP.2 113.4,15.2 104.2,15.2 v103.8,14.8 102.8,15.8 84.2,15.8 83.4,16.6 IC5.32 | v78.6,29.8 78.6,25.6 C5.1 | IC3.6 64.6,40.2 65.4,39.4 87.8,39.4 88.6,40.2 IC4.6
VCCDISP
  Top 0.25: C2.1 110,43.2 IC1.4 110.4,43.6 110.8,43.6 110.8,45 110.4,45.4 IC1.6 110,45.6 L1.1 109.4,49.6 109,50 109,69.4 106.2,72.2 15,72.2 15,71.2 VFD.37 VFD.38 12.2,68.8 8.8,65.4 8.8,53.6 9.4,53 C12.1 10,50.6 IC7.2 10.6,48.8 10.6,46.2 14.4,46.2 R19.1
VCCSWITCHED
  Top 0.25: C20.1 7,50 IC7.3 8.4,48.8 10,47.2 10,46.2 11.4,44.8 13.2,44.8 13.2,41.8 Q3.3 14.6,40.4 14.6,38.8 16,37.4 17.2,37.4 | 17.2,37.4 18.4,37.4 18.4,37.8 C21.2 | R10.1 58.4,11.4 57.6,11.4 57.6,6.8 57.2,6.4 53.4,6.4 53.4,4.4 18.6,4.4 18.6,13.8 C19.+ 17.2,16.4 17.2,37.4

### Text on the board
tNames: DICKTIERANZEIGEGERÄT V 1.1